# EAGLE design tactile (EAGLE 5.10)
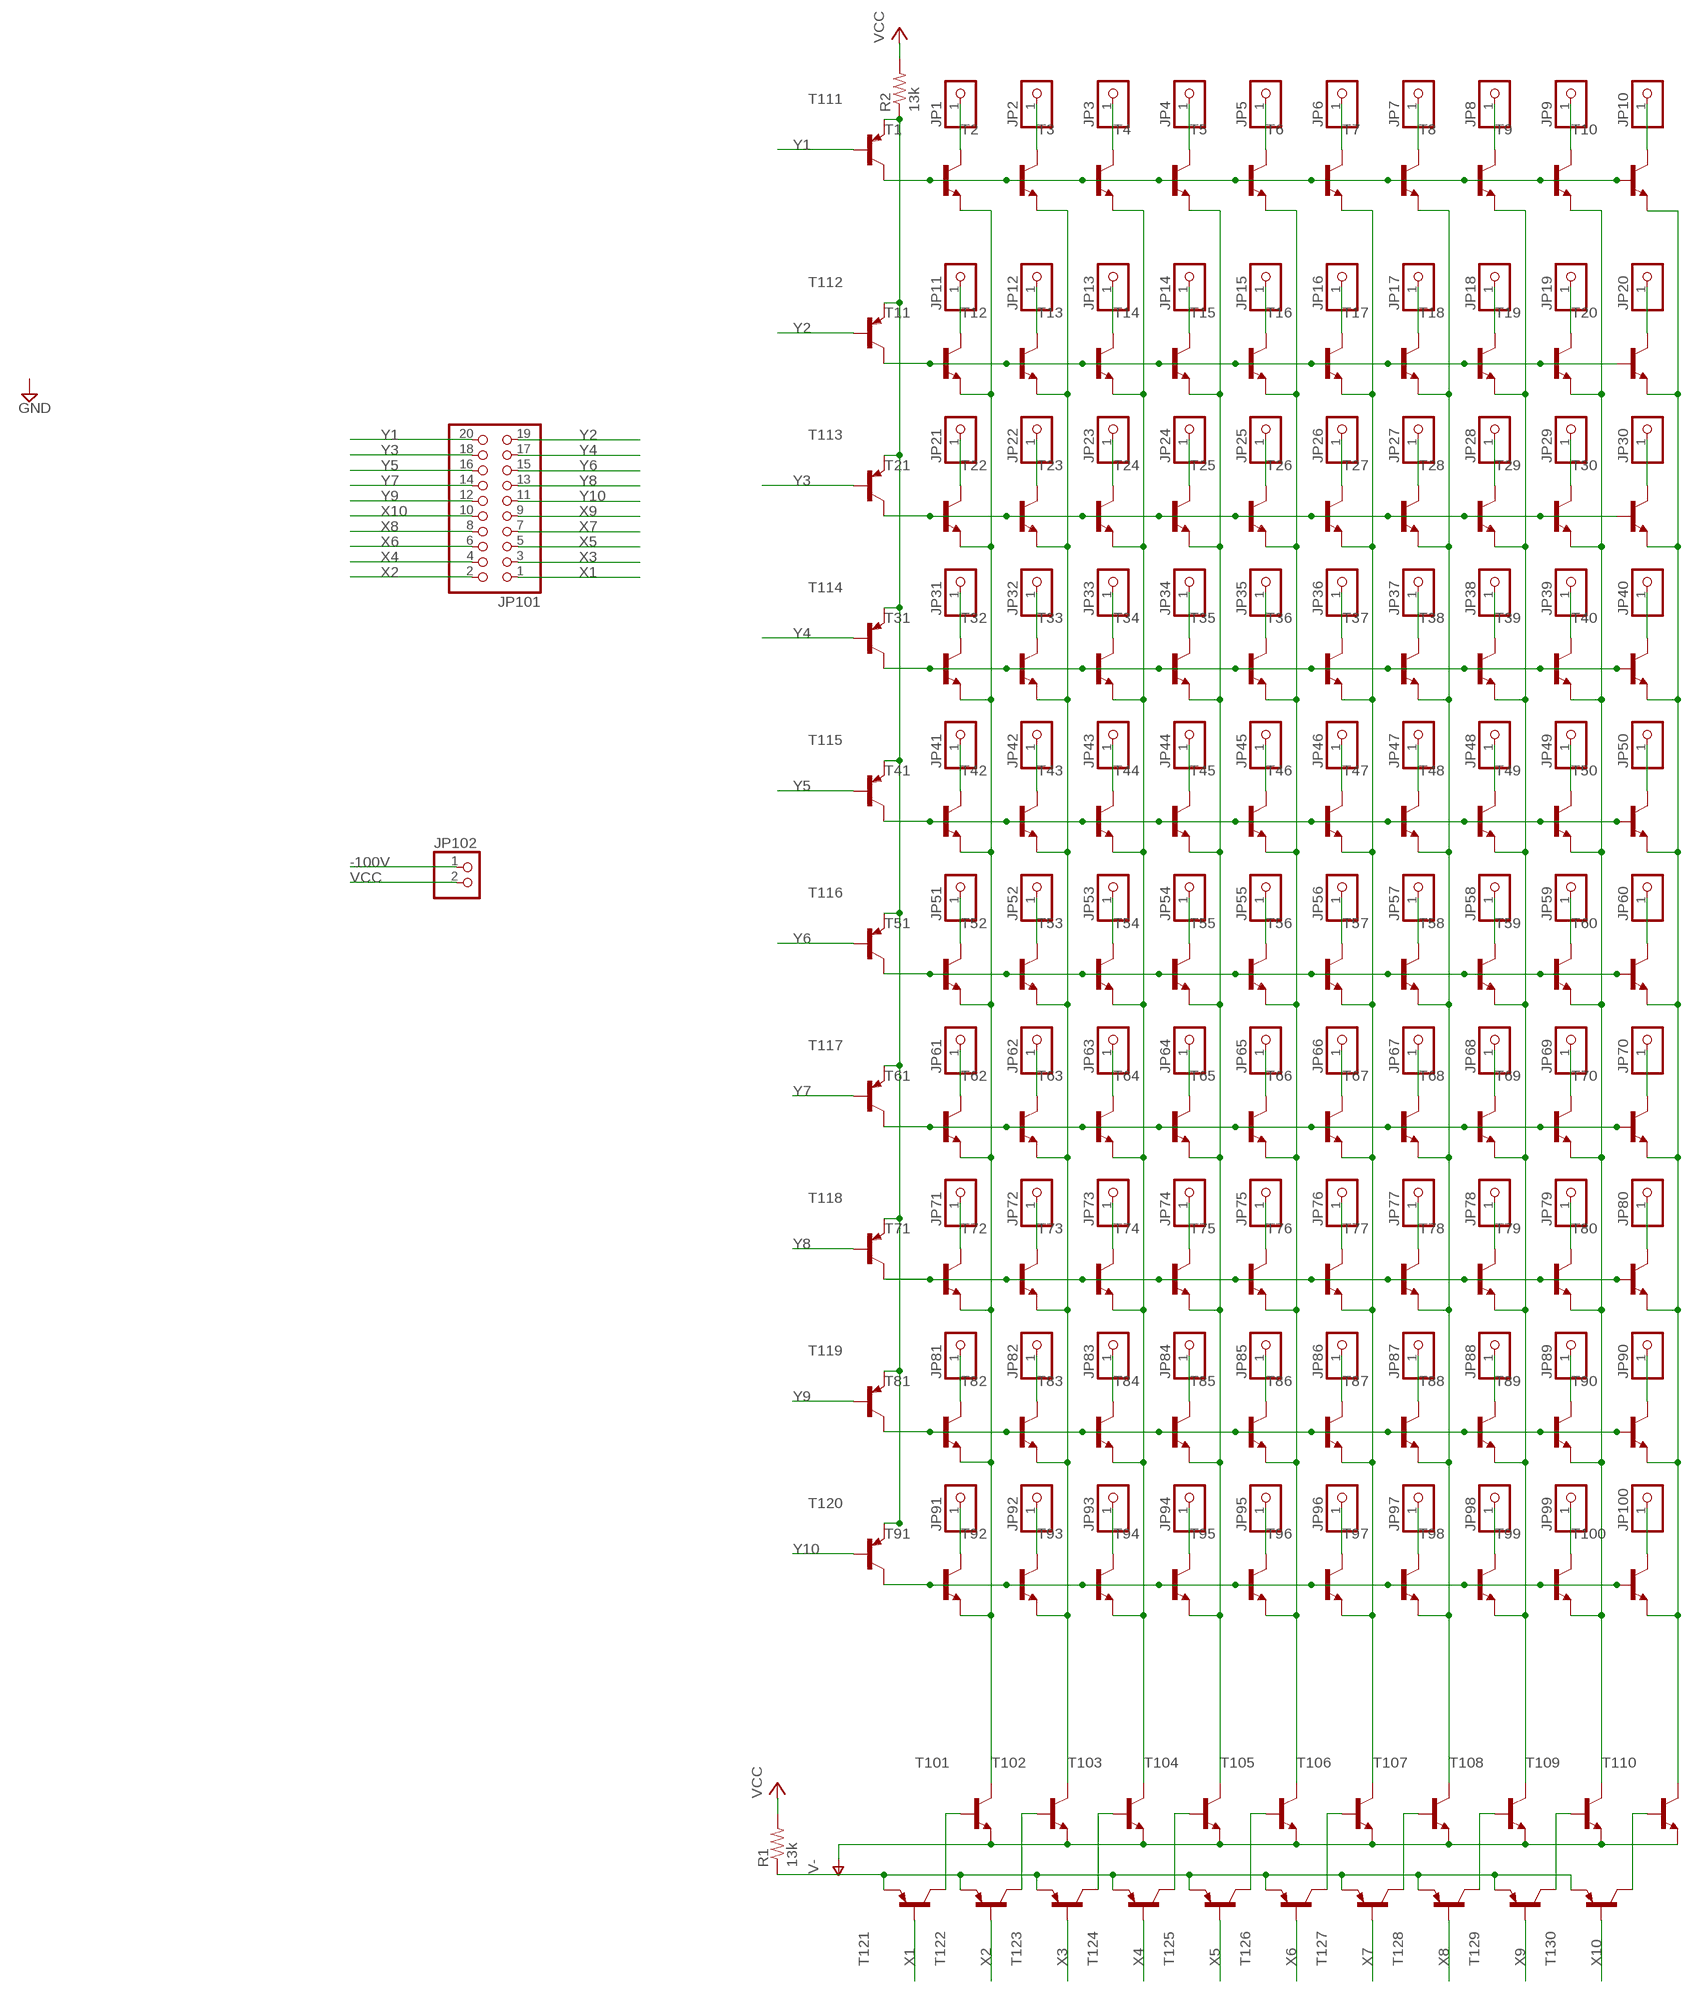
[diagram p0: schematic, sheet 1]

## Parts
JP1  PINHD-1X1  [1X01]
JP2  PINHD-1X1  [1X01]
JP3  PINHD-1X1  [1X01]
JP4  PINHD-1X1  [1X01]
JP5  PINHD-1X1  [1X01]
JP6  PINHD-1X1  [1X01]
JP7  PINHD-1X1  [1X01]
JP8  PINHD-1X1  [1X01]
JP9  PINHD-1X1  [1X01]
JP10  PINHD-1X1  [1X01]
JP11  PINHD-1X1  [1X01]
JP12  PINHD-1X1  [1X01]
JP13  PINHD-1X1  [1X01]
JP14  PINHD-1X1  [1X01]
JP15  PINHD-1X1  [1X01]
JP16  PINHD-1X1  [1X01]
JP17  PINHD-1X1  [1X01]
JP18  PINHD-1X1  [1X01]
JP19  PINHD-1X1  [1X01]
JP20  PINHD-1X1  [1X01]
JP21  PINHD-1X1  [1X01]
JP22  PINHD-1X1  [1X01]
JP23  PINHD-1X1  [1X01]
JP24  PINHD-1X1  [1X01]
JP25  PINHD-1X1  [1X01]
JP26  PINHD-1X1  [1X01]
JP27  PINHD-1X1  [1X01]
JP28  PINHD-1X1  [1X01]
JP29  PINHD-1X1  [1X01]
JP30  PINHD-1X1  [1X01]
JP31  PINHD-1X1  [1X01]
JP32  PINHD-1X1  [1X01]
JP33  PINHD-1X1  [1X01]
JP34  PINHD-1X1  [1X01]
JP35  PINHD-1X1  [1X01]
JP36  PINHD-1X1  [1X01]
JP37  PINHD-1X1  [1X01]
JP38  PINHD-1X1  [1X01]
JP39  PINHD-1X1  [1X01]
JP40  PINHD-1X1  [1X01]
JP41  PINHD-1X1  [1X01]
JP42  PINHD-1X1  [1X01]
JP43  PINHD-1X1  [1X01]
JP44  PINHD-1X1  [1X01]
JP45  PINHD-1X1  [1X01]
JP46  PINHD-1X1  [1X01]
JP47  PINHD-1X1  [1X01]
JP48  PINHD-1X1  [1X01]
JP49  PINHD-1X1  [1X01]
JP50  PINHD-1X1  [1X01]
JP51  PINHD-1X1  [1X01]
JP52  PINHD-1X1  [1X01]
JP53  PINHD-1X1  [1X01]
JP54  PINHD-1X1  [1X01]
JP55  PINHD-1X1  [1X01]
JP56  PINHD-1X1  [1X01]
JP57  PINHD-1X1  [1X01]
JP58  PINHD-1X1  [1X01]
JP59  PINHD-1X1  [1X01]
JP60  PINHD-1X1  [1X01]
JP61  PINHD-1X1  [1X01]
JP62  PINHD-1X1  [1X01]
JP63  PINHD-1X1  [1X01]
JP64  PINHD-1X1  [1X01]
JP65  PINHD-1X1  [1X01]
JP66  PINHD-1X1  [1X01]
JP67  PINHD-1X1  [1X01]
JP68  PINHD-1X1  [1X01]
JP69  PINHD-1X1  [1X01]
JP70  PINHD-1X1  [1X01]
JP71  PINHD-1X1  [1X01]
JP72  PINHD-1X1  [1X01]
JP73  PINHD-1X1  [1X01]
JP74  PINHD-1X1  [1X01]
JP75  PINHD-1X1  [1X01]
JP76  PINHD-1X1  [1X01]
JP77  PINHD-1X1  [1X01]
JP78  PINHD-1X1  [1X01]
JP79  PINHD-1X1  [1X01]
JP80  PINHD-1X1  [1X01]
JP81  PINHD-1X1  [1X01]
JP82  PINHD-1X1  [1X01]
JP83  PINHD-1X1  [1X01]
JP84  PINHD-1X1  [1X01]
JP85  PINHD-1X1  [1X01]
JP86  PINHD-1X1  [1X01]
JP87  PINHD-1X1  [1X01]
JP88  PINHD-1X1  [1X01]
JP89  PINHD-1X1  [1X01]
JP90  PINHD-1X1  [1X01]
JP91  PINHD-1X1  [1X01]
JP92  PINHD-1X1  [1X01]
JP93  PINHD-1X1  [1X01]
JP94  PINHD-1X1  [1X01]
JP95  PINHD-1X1  [1X01]
JP96  PINHD-1X1  [1X01]
JP97  PINHD-1X1  [1X01]
JP98  PINHD-1X1  [1X01]
JP99  PINHD-1X1  [1X01]
JP100  PINHD-1X1  [1X01]
JP101  PINHD-2X10/90  [2X10/90]
JP102  PINHD-1X2/90  [1X02/90]
R1  13k  R-US_M0805  [M0805]
R2  13k  R-US_M0805  [M0805]
T1  BC808-NPN-SOT23-BEC  [SOT23-BEC]
T2  BC808-NPN-SOT23-BEC  [SOT23-BEC]
T3  BC808-NPN-SOT23-BEC  [SOT23-BEC]
T4  BC808-NPN-SOT23-BEC  [SOT23-BEC]
T5  BC808-NPN-SOT23-BEC  [SOT23-BEC]
T6  BC808-NPN-SOT23-BEC  [SOT23-BEC]
T7  BC808-NPN-SOT23-BEC  [SOT23-BEC]
T8  BC808-NPN-SOT23-BEC  [SOT23-BEC]
T9  BC808-NPN-SOT23-BEC  [SOT23-BEC]
T10  BC808-NPN-SOT23-BEC  [SOT23-BEC]
T11  BC808-NPN-SOT23-BEC  [SOT23-BEC]
T12  BC808-NPN-SOT23-BEC  [SOT23-BEC]
T13  BC808-NPN-SOT23-BEC  [SOT23-BEC]
T14  BC808-NPN-SOT23-BEC  [SOT23-BEC]
T15  BC808-NPN-SOT23-BEC  [SOT23-BEC]
T16  BC808-NPN-SOT23-BEC  [SOT23-BEC]
T17  BC808-NPN-SOT23-BEC  [SOT23-BEC]
T18  BC808-NPN-SOT23-BEC  [SOT23-BEC]
T19  BC808-NPN-SOT23-BEC  [SOT23-BEC]
T20  BC808-NPN-SOT23-BEC  [SOT23-BEC]
T21  BC808-NPN-SOT23-BEC  [SOT23-BEC]
T22  BC808-NPN-SOT23-BEC  [SOT23-BEC]
T23  BC808-NPN-SOT23-BEC  [SOT23-BEC]
T24  BC808-NPN-SOT23-BEC  [SOT23-BEC]
T25  BC808-NPN-SOT23-BEC  [SOT23-BEC]
T26  BC808-NPN-SOT23-BEC  [SOT23-BEC]
T27  BC808-NPN-SOT23-BEC  [SOT23-BEC]
T28  BC808-NPN-SOT23-BEC  [SOT23-BEC]
T29  BC808-NPN-SOT23-BEC  [SOT23-BEC]
T30  BC808-NPN-SOT23-BEC  [SOT23-BEC]
T31  BC808-NPN-SOT23-BEC  [SOT23-BEC]
T32  BC808-NPN-SOT23-BEC  [SOT23-BEC]
T33  BC808-NPN-SOT23-BEC  [SOT23-BEC]
T34  BC808-NPN-SOT23-BEC  [SOT23-BEC]
T35  BC808-NPN-SOT23-BEC  [SOT23-BEC]
T36  BC808-NPN-SOT23-BEC  [SOT23-BEC]
T37  BC808-NPN-SOT23-BEC  [SOT23-BEC]
T38  BC808-NPN-SOT23-BEC  [SOT23-BEC]
T39  BC808-NPN-SOT23-BEC  [SOT23-BEC]
T40  BC808-NPN-SOT23-BEC  [SOT23-BEC]
T41  BC808-NPN-SOT23-BEC  [SOT23-BEC]
T42  BC808-NPN-SOT23-BEC  [SOT23-BEC]
T43  BC808-NPN-SOT23-BEC  [SOT23-BEC]
T44  BC808-NPN-SOT23-BEC  [SOT23-BEC]
T45  BC808-NPN-SOT23-BEC  [SOT23-BEC]
T46  BC808-NPN-SOT23-BEC  [SOT23-BEC]
T47  BC808-NPN-SOT23-BEC  [SOT23-BEC]
T48  BC808-NPN-SOT23-BEC  [SOT23-BEC]
T49  BC808-NPN-SOT23-BEC  [SOT23-BEC]
T50  BC808-NPN-SOT23-BEC  [SOT23-BEC]
T51  BC808-NPN-SOT23-BEC  [SOT23-BEC]
T52  BC808-NPN-SOT23-BEC  [SOT23-BEC]
T53  BC808-NPN-SOT23-BEC  [SOT23-BEC]
T54  BC808-NPN-SOT23-BEC  [SOT23-BEC]
T55  BC808-NPN-SOT23-BEC  [SOT23-BEC]
T56  BC808-NPN-SOT23-BEC  [SOT23-BEC]
T57  BC808-NPN-SOT23-BEC  [SOT23-BEC]
T58  BC808-NPN-SOT23-BEC  [SOT23-BEC]
T59  BC808-NPN-SOT23-BEC  [SOT23-BEC]
T60  BC808-NPN-SOT23-BEC  [SOT23-BEC]
T61  BC808-NPN-SOT23-BEC  [SOT23-BEC]
T62  BC808-NPN-SOT23-BEC  [SOT23-BEC]
T63  BC808-NPN-SOT23-BEC  [SOT23-BEC]
T64  BC808-NPN-SOT23-BEC  [SOT23-BEC]
T65  BC808-NPN-SOT23-BEC  [SOT23-BEC]
T66  BC808-NPN-SOT23-BEC  [SOT23-BEC]
T67  BC808-NPN-SOT23-BEC  [SOT23-BEC]
T68  BC808-NPN-SOT23-BEC  [SOT23-BEC]
T69  BC808-NPN-SOT23-BEC  [SOT23-BEC]
T70  BC808-NPN-SOT23-BEC  [SOT23-BEC]
T71  BC808-NPN-SOT23-BEC  [SOT23-BEC]
T72  BC808-NPN-SOT23-BEC  [SOT23-BEC]
T73  BC808-NPN-SOT23-BEC  [SOT23-BEC]
T74  BC808-NPN-SOT23-BEC  [SOT23-BEC]
T75  BC808-NPN-SOT23-BEC  [SOT23-BEC]
T76  BC808-NPN-SOT23-BEC  [SOT23-BEC]
T77  BC808-NPN-SOT23-BEC  [SOT23-BEC]
T78  BC808-NPN-SOT23-BEC  [SOT23-BEC]
T79  BC808-NPN-SOT23-BEC  [SOT23-BEC]
T80  BC808-NPN-SOT23-BEC  [SOT23-BEC]
T81  BC808-NPN-SOT23-BEC  [SOT23-BEC]
T82  BC808-NPN-SOT23-BEC  [SOT23-BEC]
T83  BC808-NPN-SOT23-BEC  [SOT23-BEC]
T84  BC808-NPN-SOT23-BEC  [SOT23-BEC]
T85  BC808-NPN-SOT23-BEC  [SOT23-BEC]
T86  BC808-NPN-SOT23-BEC  [SOT23-BEC]
T87  BC808-NPN-SOT23-BEC  [SOT23-BEC]
T88  BC808-NPN-SOT23-BEC  [SOT23-BEC]
T89  BC808-NPN-SOT23-BEC  [SOT23-BEC]
T90  BC808-NPN-SOT23-BEC  [SOT23-BEC]
T91  BC808-NPN-SOT23-BEC  [SOT23-BEC]
T92  BC808-NPN-SOT23-BEC  [SOT23-BEC]
T93  BC808-NPN-SOT23-BEC  [SOT23-BEC]
T94  BC808-NPN-SOT23-BEC  [SOT23-BEC]
T95  BC808-NPN-SOT23-BEC  [SOT23-BEC]
T96  BC808-NPN-SOT23-BEC  [SOT23-BEC]
T97  BC808-NPN-SOT23-BEC  [SOT23-BEC]
T98  BC808-NPN-SOT23-BEC  [SOT23-BEC]
T99  BC808-NPN-SOT23-BEC  [SOT23-BEC]
T100  BC808-NPN-SOT23-BEC  [SOT23-BEC]
T101  BC808-NPN-SOT23-BEC  [SOT23-BEC]
T102  BC808-NPN-SOT23-BEC  [SOT23-BEC]
T103  BC808-NPN-SOT23-BEC  [SOT23-BEC]
T104  BC808-NPN-SOT23-BEC  [SOT23-BEC]
T105  BC808-NPN-SOT23-BEC  [SOT23-BEC]
T106  BC808-NPN-SOT23-BEC  [SOT23-BEC]
T107  BC808-NPN-SOT23-BEC  [SOT23-BEC]
T108  BC808-NPN-SOT23-BEC  [SOT23-BEC]
T109  BC808-NPN-SOT23-BEC  [SOT23-BEC]
T110  BC808-NPN-SOT23-BEC  [SOT23-BEC]
T111  BC807-16-PNP-SOT23-BEC  [SOT23-BEC]
T112  BC807-16-PNP-SOT23-BEC  [SOT23-BEC]
T113  BC807-16-PNP-SOT23-BEC  [SOT23-BEC]
T114  BC807-16-PNP-SOT23-BEC  [SOT23-BEC]
T115  BC807-16-PNP-SOT23-BEC  [SOT23-BEC]
T116  BC807-16-PNP-SOT23-BEC  [SOT23-BEC]
T117  BC807-16-PNP-SOT23-BEC  [SOT23-BEC]
T118  BC807-16-PNP-SOT23-BEC  [SOT23-BEC]
T119  BC807-16-PNP-SOT23-BEC  [SOT23-BEC]
T120  BC807-16-PNP-SOT23-BEC  [SOT23-BEC]
T121  BC807-16-PNP-SOT23-BEC  [SOT23-BEC]
T122  BC807-16-PNP-SOT23-BEC  [SOT23-BEC]
T123  BC807-16-PNP-SOT23-BEC  [SOT23-BEC]
T124  BC807-16-PNP-SOT23-BEC  [SOT23-BEC]
T125  BC807-16-PNP-SOT23-BEC  [SOT23-BEC]
T126  BC807-16-PNP-SOT23-BEC  [SOT23-BEC]
T127  BC807-16-PNP-SOT23-BEC  [SOT23-BEC]
T128  BC807-16-PNP-SOT23-BEC  [SOT23-BEC]
T129  BC807-16-PNP-SOT23-BEC  [SOT23-BEC]
T130  BC807-16-PNP-SOT23-BEC  [SOT23-BEC]

## Nets
-100V: JP102.1 T101.E T102.E T103.E T104.E T105.E T106.E T107.E T108.E T109.E T110.E ; supply symbol labelled V-
N$1: T1.B T2.B T3.B T4.B T5.B T6.B T7.B T8.B T9.B T10.B T111.C
N$2: JP1.1 T1.C
N$3: JP2.1 T2.C
N$4: JP3.1 T3.C
N$5: JP4.1 T4.C
N$6: JP5.1 T5.C
N$7: JP6.1 T6.C
N$8: JP7.1 T7.C
N$9: JP8.1 T8.C
N$10: JP9.1 T9.C
N$11: JP10.1 T10.C
N$12: T11.B T12.B T13.B T14.B T15.B T16.B T17.B T18.B T19.B T20.B T112.C
N$13: JP11.1 T11.C
N$14: JP12.1 T12.C
N$15: JP13.1 T13.C
N$16: JP14.1 T14.C
N$17: JP15.1 T15.C
N$18: JP16.1 T16.C
N$19: JP17.1 T17.C
N$20: JP18.1 T18.C
N$21: JP19.1 T19.C
N$22: JP20.1 T20.C
N$23: T1.E T11.E T21.E T31.E T41.E T51.E T61.E T71.E T81.E T91.E T101.C
N$24: T2.E T12.E T22.E T32.E T42.E T52.E T62.E T72.E T82.E T92.E T102.C
N$25: T3.E T13.E T23.E T33.E T43.E T53.E T63.E T73.E T83.E T93.E T103.C
N$26: T4.E T14.E T24.E T34.E T44.E T54.E T64.E T74.E T84.E T94.E T104.C
N$27: T5.E T15.E T25.E T35.E T45.E T55.E T65.E T75.E T85.E T95.E T105.C
N$28: T6.E T16.E T26.E T36.E T46.E T56.E T66.E T76.E T86.E T96.E T106.C
N$29: T7.E T17.E T27.E T37.E T47.E T57.E T67.E T77.E T87.E T97.E T107.C
N$30: T8.E T18.E T28.E T38.E T48.E T58.E T68.E T78.E T88.E T98.E T108.C
N$31: T9.E T19.E T29.E T39.E T49.E T59.E T69.E T79.E T89.E T99.E T109.C
N$32: T10.E T20.E T30.E T40.E T50.E T60.E T70.E T80.E T90.E T100.E T110.C
N$33: T21.B T22.B T23.B T24.B T25.B T26.B T27.B T28.B T29.B T30.B T113.C
N$34: JP21.1 T21.C
N$35: JP22.1 T22.C
N$36: JP23.1 T23.C
N$37: JP24.1 T24.C
N$38: JP25.1 T25.C
N$39: JP26.1 T26.C
N$40: JP27.1 T27.C
N$41: JP28.1 T28.C
N$42: JP29.1 T29.C
N$43: JP30.1 T30.C
N$44: T91.B T92.B T93.B T94.B T95.B T96.B T97.B T98.B T99.B T100.B T120.C
N$45: JP31.1 T31.C
N$46: JP32.1 T32.C
N$47: JP33.1 T33.C
N$48: JP34.1 T34.C
N$49: JP35.1 T35.C
N$50: JP36.1 T36.C
N$51: JP37.1 T37.C
N$52: JP38.1 T38.C
N$53: JP39.1 T39.C
N$54: JP40.1 T40.C
N$55: T81.B T82.B T83.B T84.B T85.B T86.B T87.B T88.B T89.B T90.B T119.C
N$56: JP41.1 T41.C
N$57: JP42.1 T42.C
N$58: JP43.1 T43.C
N$59: JP44.1 T44.C
N$60: JP45.1 T45.C
N$61: JP46.1 T46.C
N$62: JP47.1 T47.C
N$63: JP48.1 T48.C
N$64: JP49.1 T49.C
N$65: JP50.1 T50.C
N$66: T71.B T72.B T73.B T74.B T75.B T76.B T77.B T78.B T79.B T80.B T118.C
N$67: JP51.1 T51.C
N$68: JP52.1 T52.C
N$69: JP53.1 T53.C
N$70: JP54.1 T54.C
N$71: JP55.1 T55.C
N$72: JP56.1 T56.C
N$73: JP57.1 T57.C
N$74: JP58.1 T58.C
N$75: JP59.1 T59.C
N$76: JP60.1 T60.C
N$77: T61.B T62.B T63.B T64.B T65.B T66.B T67.B T68.B T69.B T70.B T117.C
N$78: JP61.1 T61.C
N$79: JP62.1 T62.C
N$80: JP63.1 T63.C
N$81: JP64.1 T64.C
N$82: JP65.1 T65.C
N$83: JP66.1 T66.C
N$84: JP67.1 T67.C
N$85: JP68.1 T68.C
N$86: JP69.1 T69.C
N$87: JP70.1 T70.C
N$88: T51.B T52.B T53.B T54.B T55.B T56.B T57.B T58.B T59.B T60.B T116.C
N$89: JP71.1 T71.C
N$90: JP72.1 T72.C
N$91: JP73.1 T73.C
N$92: JP74.1 T74.C
N$93: JP75.1 T75.C
N$94: JP76.1 T76.C
N$95: JP77.1 T77.C
N$96: JP78.1 T78.C
N$97: JP79.1 T79.C
N$98: JP80.1 T80.C
N$99: T41.B T42.B T43.B T44.B T45.B T46.B T47.B T48.B T49.B T50.B T115.C
N$100: JP81.1 T81.C
N$101: JP82.1 T82.C
N$102: JP83.1 T83.C
N$103: JP84.1 T84.C
N$104: JP85.1 T85.C
N$105: JP86.1 T86.C
N$106: JP87.1 T87.C
N$107: JP88.1 T88.C
N$108: JP89.1 T89.C
N$109: JP90.1 T90.C
N$110: T31.B T32.B T33.B T34.B T35.B T36.B T37.B T38.B T39.B T40.B T114.C
N$111: JP91.1 T91.C
N$112: JP92.1 T92.C
N$113: JP93.1 T93.C
N$114: JP94.1 T94.C
N$115: JP95.1 T95.C
N$116: JP96.1 T96.C
N$117: JP97.1 T97.C
N$118: JP98.1 T98.C
N$119: JP99.1 T99.C
N$120: JP100.1 T100.C
N$121: T101.B T121.C
N$122: T102.B T122.C
N$123: T103.B T123.C
N$124: T104.B T124.C
N$125: T105.B T125.C
N$126: T106.B T126.C
N$127: T107.B T127.C
N$128: T108.B T128.C
N$129: T109.B T129.C
N$130: T110.B T130.C
N$131: R1.1 T121.E T122.E T123.E T124.E T125.E T126.E T127.E T128.E T129.E T130.E
N$132: R2.1 T111.E T112.E T113.E T114.E T115.E T116.E T117.E T118.E T119.E T120.E
VCC: JP102.2 R1.2 R2.2
X1: JP101.1 T121.B
X2: JP101.2 T122.B
X3: JP101.3 T123.B
X4: JP101.4 T124.B
X5: JP101.5 T125.B
X6: JP101.6 T126.B
X7: JP101.7 T127.B
X8: JP101.8 T128.B
X9: JP101.9 T129.B
X10: JP101.10 T130.B
Y1: JP101.20 T111.B
Y2: JP101.19 T112.B
Y3: JP101.18 T113.B
Y4: JP101.17 T114.B
Y5: JP101.16 T115.B
Y6: JP101.15 T116.B
Y7: JP101.14 T117.B
Y8: JP101.13 T118.B
Y9: JP101.12 T119.B
Y10: JP101.11 T120.B

## Library data of the parts
JP1-JP100 = pinhead:PINHD-1X1: PIN HEADER
JP101 = pinhead:PINHD-2X10: PIN HEADER
JP102 = pinhead:PINHD-1X2: PIN HEADER
R1 R2 = rcl:R-US_: RESISTOR, American symbol
T1-T110 = transistor:*-NPN-: NPN Transistror BF959 corrected 2008.03.06
T111-T130 = transistor:*-PNP-: PNP Transistror

## Board
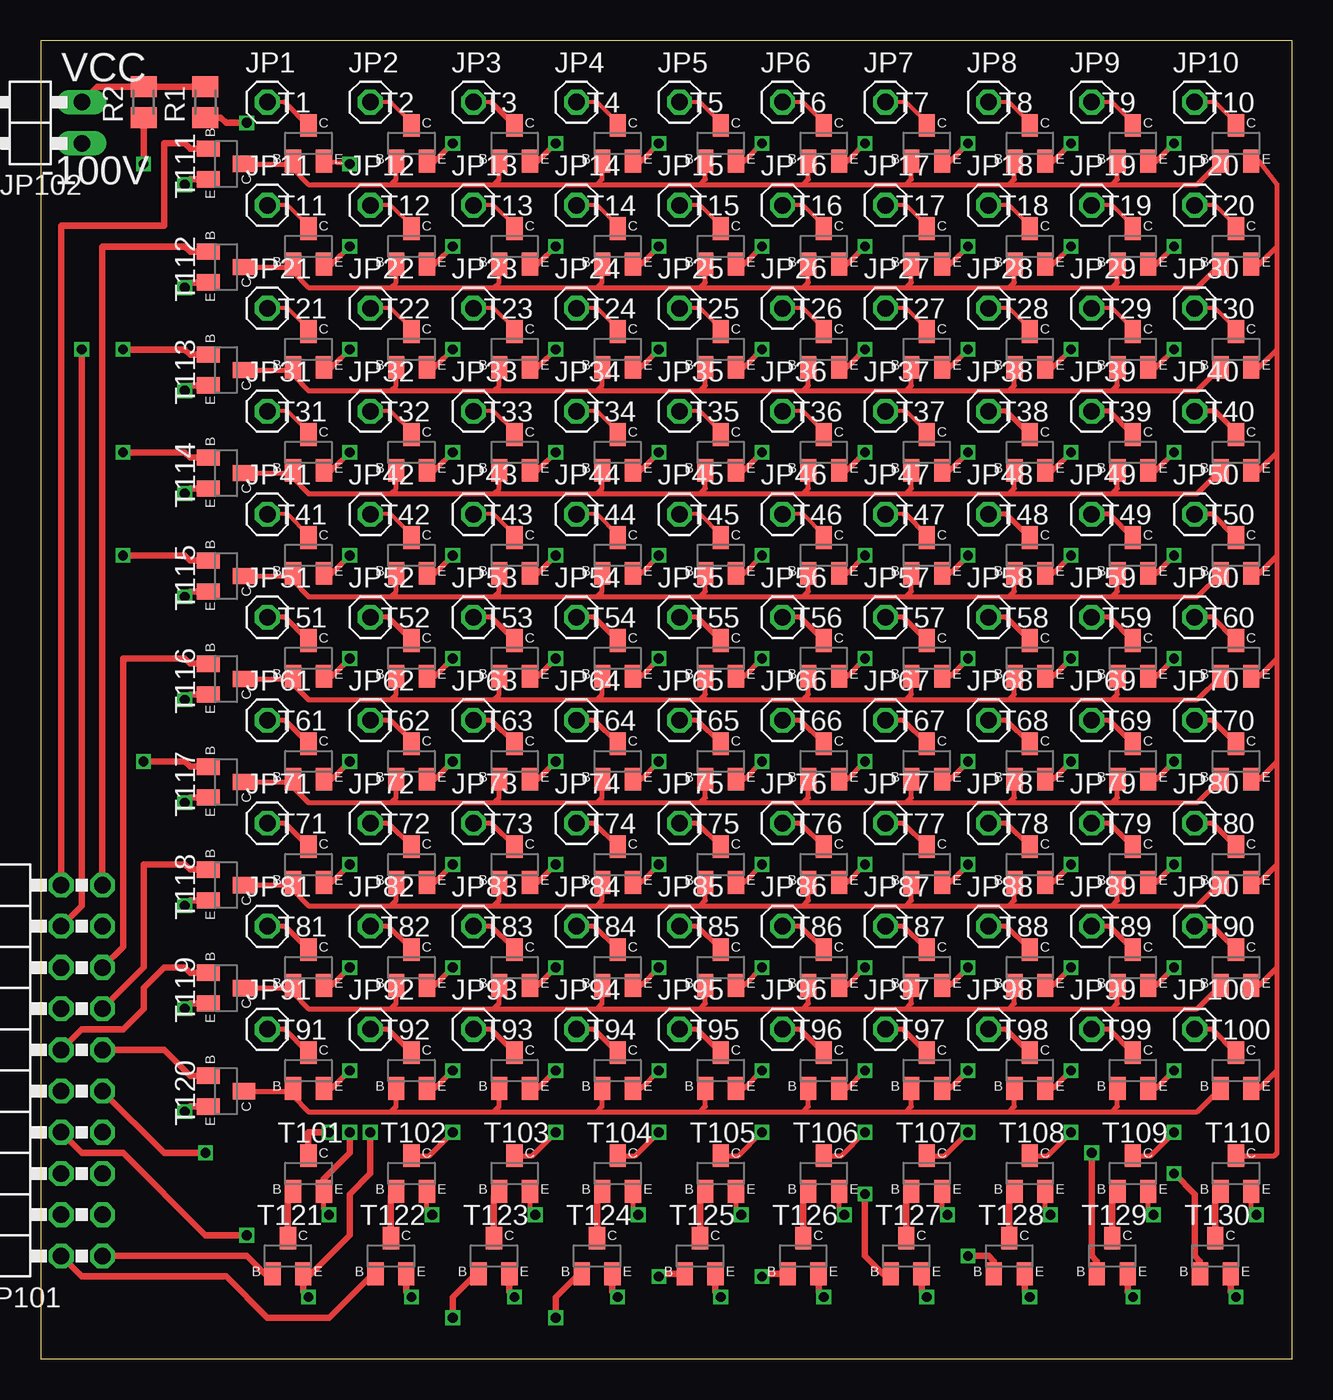
[diagram p1: board, top side]
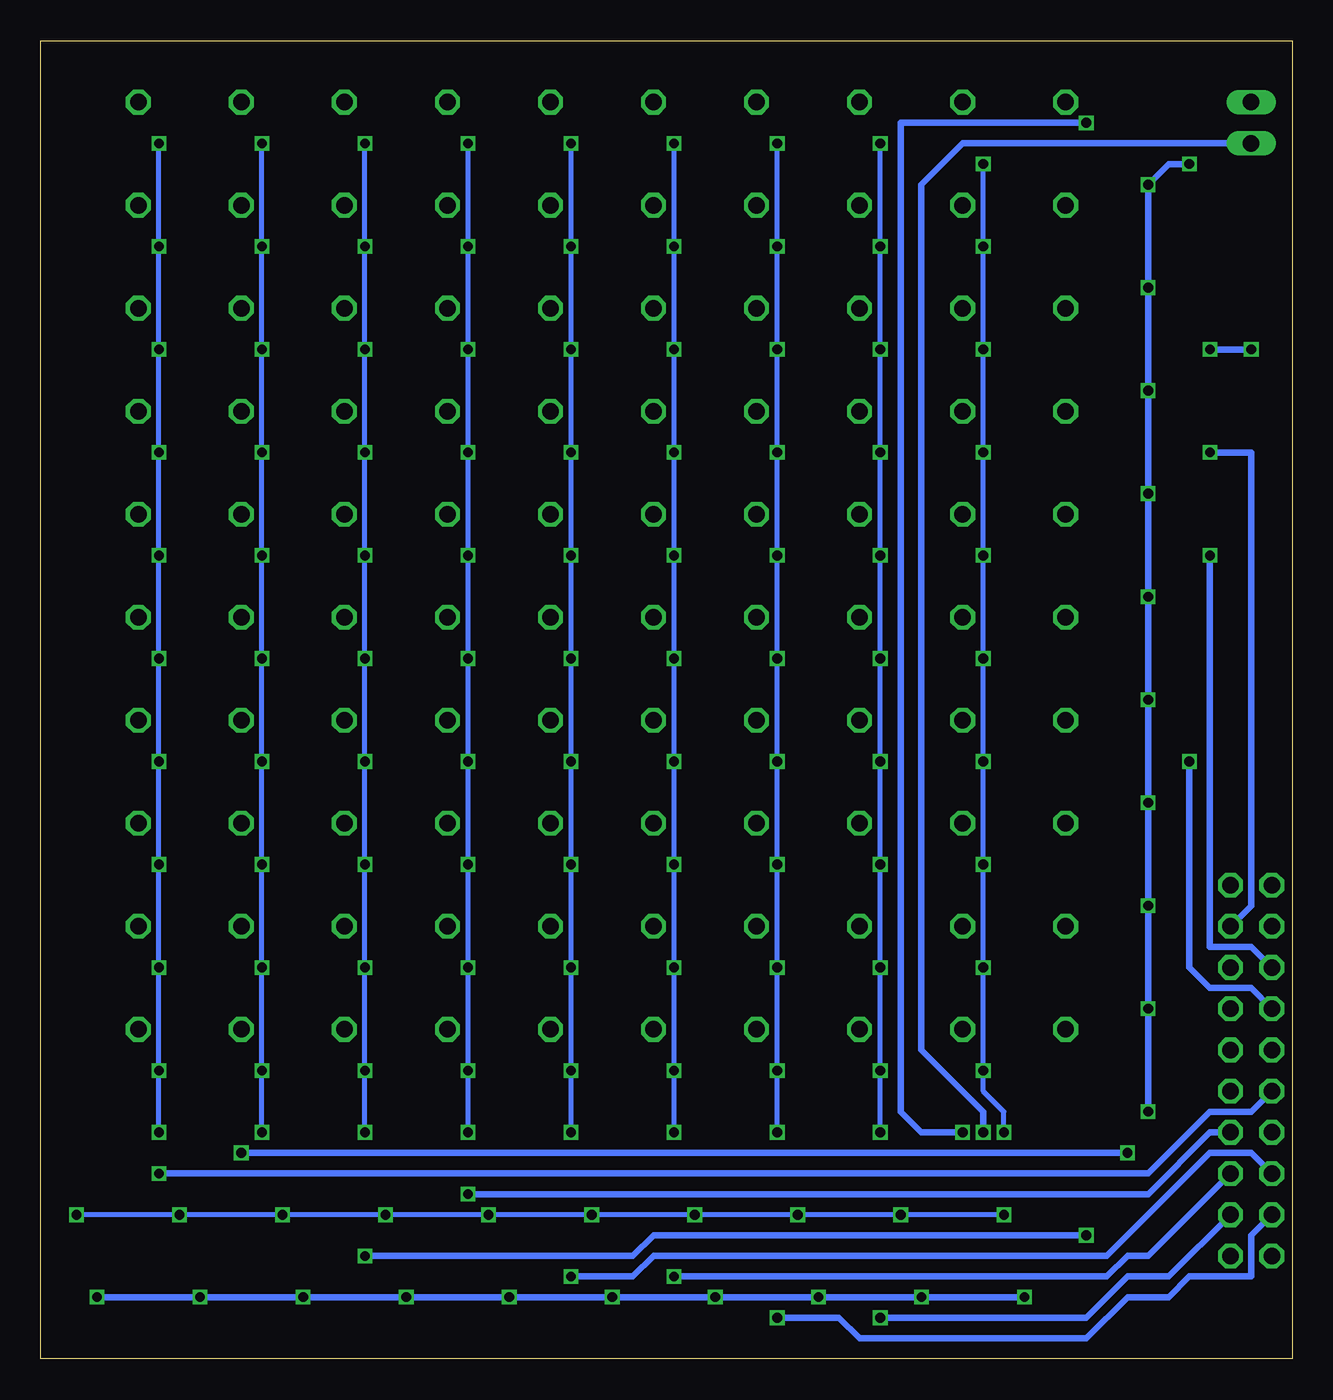
[diagram p2: board, bottom side, seen from below]

Size 77.14 x 81.27 mm. Coordinates in mm from the lower left corner, seen from the top.
Outline: 0,0 77.14,0 77.14,81.27 0,81.27 0,0
Copper layers (1*16): Top 0.035mm / dielectric 1.5mm / Bottom 0.035mm
Design rules "ITead_rule": minimum track width 6mil, minimum drill 12mil, track to track 6mil, track to pad 6mil, pad to pad 6mil, via to via 6mil, smd to smd 0mil, copper to edge 10mil, drill to drill 10mil, minimum pad ring 10mil, minimum via ring 6mil, stop-mask expansion 2mil, vias tented up to drill 100mil, thermal gap 10mil

### Footprints (pad centres in the part's own frame; a part is rotated, then mirrored left to right if it is on the bottom)
1X01 = drill 1.016 octagon: 1 0,0
2X10/90 = drill 1.016 octagon: 1 -11.43,-6.35; 2 -11.43,-3.81; 3 -8.89,-6.35; 4 -8.89,-3.81; 5 -6.35,-6.35; 6 -6.35,-3.81; 7 -3.81,-6.35; 8 -3.81,-3.81; 9 -1.27,-6.35; 10 -1.27,-3.81; 11 1.27,-6.35; 12 1.27,-3.81; 13 3.81,-6.35; 14 3.81,-3.81; 15 6.35,-6.35; 16 6.35,-3.81; 17 8.89,-6.35; 18 8.89,-3.81; 19 11.43,-6.35; 20 11.43,-3.81
1X02/90 = drill 1.016 long: 1 -1.27,-3.81; 2 1.27,-3.81
M0805 = smd 1.3 x 1.6: 1 -0.95,0; 2 0.95,0
SOT23-BEC = smd 1 x 1.4: B -0.95,-1.1; C 0,1.1; E 0.95,-1.1

### Placement (x,y rotation side)
JP1  13.97,77.47 0 top
JP2  20.32,77.47 0 top
JP3  26.67,77.47 0 top
JP4  33.02,77.47 0 top
JP5  39.37,77.47 0 top
JP6  45.72,77.47 0 top
JP7  52.07,77.47 0 top
JP8  58.42,77.47 0 top
JP9  64.77,77.47 0 top
JP10  71.12,77.47 0 top
JP11  13.97,71.12 0 top
JP12  20.32,71.12 0 top
JP13  26.67,71.12 0 top
JP14  33.02,71.12 0 top
JP15  39.37,71.12 0 top
JP16  45.72,71.12 0 top
JP17  52.07,71.12 0 top
JP18  58.42,71.12 0 top
JP19  64.77,71.12 0 top
JP20  71.12,71.12 0 top
JP21  13.97,64.77 0 top
JP22  20.32,64.77 0 top
JP23  26.67,64.77 0 top
JP24  33.02,64.77 0 top
JP25  39.37,64.77 0 top
JP26  45.72,64.77 0 top
JP27  52.07,64.77 0 top
JP28  58.42,64.77 0 top
JP29  64.77,64.77 0 top
JP30  71.12,64.77 0 top
JP31  13.97,58.42 0 top
JP32  20.32,58.42 0 top
JP33  26.67,58.42 0 top
JP34  33.02,58.42 0 top
JP35  39.37,58.42 0 top
JP36  45.72,58.42 0 top
JP37  52.07,58.42 0 top
JP38  58.42,58.42 0 top
JP39  64.77,58.42 0 top
JP40  71.12,58.42 0 top
JP41  13.97,52.07 0 top
JP42  20.32,52.07 0 top
JP43  26.67,52.07 0 top
JP44  33.02,52.07 0 top
JP45  39.37,52.07 0 top
JP46  45.72,52.07 0 top
JP47  52.07,52.07 0 top
JP48  58.42,52.07 0 top
JP49  64.77,52.07 0 top
JP50  71.12,52.07 0 top
JP51  13.97,45.72 0 top
JP52  20.32,45.72 0 top
JP53  26.67,45.72 0 top
JP54  33.02,45.72 0 top
JP55  39.37,45.72 0 top
JP56  45.72,45.72 0 top
JP57  52.07,45.72 0 top
JP58  58.42,45.72 0 top
JP59  64.77,45.72 0 top
JP60  71.12,45.72 0 top
JP61  13.97,39.37 0 top
JP62  20.32,39.37 0 top
JP63  26.67,39.37 0 top
JP64  33.02,39.37 0 top
JP65  39.37,39.37 0 top
JP66  45.72,39.37 0 top
JP67  52.07,39.37 0 top
JP68  58.42,39.37 0 top
JP69  64.77,39.37 0 top
JP70  71.12,39.37 0 top
JP71  13.97,33.02 0 top
JP72  20.32,33.02 0 top
JP73  26.67,33.02 0 top
JP74  33.02,33.02 0 top
JP75  39.37,33.02 0 top
JP76  45.72,33.02 0 top
JP77  52.07,33.02 0 top
JP78  58.42,33.02 0 top
JP79  64.77,33.02 0 top
JP80  71.12,33.02 0 top
JP81  13.97,26.67 0 top
JP82  20.32,26.67 0 top
JP83  26.67,26.67 0 top
JP84  33.02,26.67 0 top
JP85  39.37,26.67 0 top
JP86  45.72,26.67 0 top
JP87  52.07,26.67 0 top
JP88  58.42,26.67 0 top
JP89  64.77,26.67 0 top
JP90  71.12,26.67 0 top
JP91  13.97,20.32 0 top
JP92  20.32,20.32 0 top
JP93  26.67,20.32 0 top
JP94  33.02,20.32 0 top
JP95  39.37,20.32 0 top
JP96  45.72,20.32 0 top
JP97  52.07,20.32 0 top
JP98  58.42,20.32 0 top
JP99  64.77,20.32 0 top
JP100  71.12,20.32 0 top
JP101  -2.54,17.78 90 top
JP102  -1.27,76.2 90 top
R1  10.16,77.47 90 top
R2  6.35,77.47 90 top
T1  16.51,74.93 0 top
T2  22.86,74.93 0 top
T3  29.21,74.93 0 top
T4  35.56,74.93 0 top
T5  41.91,74.93 0 top
T6  48.26,74.93 0 top
T7  54.61,74.93 0 top
T8  60.96,74.93 0 top
T9  67.31,74.93 0 top
T10  73.66,74.93 0 top
T11  16.51,68.58 0 top
T12  22.86,68.58 0 top
T13  29.21,68.58 0 top
T14  35.56,68.58 0 top
T15  41.91,68.58 0 top
T16  48.26,68.58 0 top
T17  54.61,68.58 0 top
T18  60.96,68.58 0 top
T19  67.31,68.58 0 top
T20  73.66,68.58 0 top
T21  16.51,62.23 0 top
T22  22.86,62.23 0 top
T23  29.21,62.23 0 top
T24  35.56,62.23 0 top
T25  41.91,62.23 0 top
T26  48.26,62.23 0 top
T27  54.61,62.23 0 top
T28  60.96,62.23 0 top
T29  67.31,62.23 0 top
T30  73.66,62.23 0 top
T31  16.51,55.88 0 top
T32  22.86,55.88 0 top
T33  29.21,55.88 0 top
T34  35.56,55.88 0 top
T35  41.91,55.88 0 top
T36  48.26,55.88 0 top
T37  54.61,55.88 0 top
T38  60.96,55.88 0 top
T39  67.31,55.88 0 top
T40  73.66,55.88 0 top
T41  16.51,49.53 0 top
T42  22.86,49.53 0 top
T43  29.21,49.53 0 top
T44  35.56,49.53 0 top
T45  41.91,49.53 0 top
T46  48.26,49.53 0 top
T47  54.61,49.53 0 top
T48  60.96,49.53 0 top
T49  67.31,49.53 0 top
T50  73.66,49.53 0 top
T51  16.51,43.18 0 top
T52  22.86,43.18 0 top
T53  29.21,43.18 0 top
T54  35.56,43.18 0 top
T55  41.91,43.18 0 top
T56  48.26,43.18 0 top
T57  54.61,43.18 0 top
T58  60.96,43.18 0 top
T59  67.31,43.18 0 top
T60  73.66,43.18 0 top
T61  16.51,36.83 0 top
T62  22.86,36.83 0 top
T63  29.21,36.83 0 top
T64  35.56,36.83 0 top
T65  41.91,36.83 0 top
T66  48.26,36.83 0 top
T67  54.61,36.83 0 top
T68  60.96,36.83 0 top
T69  67.31,36.83 0 top
T70  73.66,36.83 0 top
T71  16.51,30.48 0 top
T72  22.86,30.48 0 top
T73  29.21,30.48 0 top
T74  35.56,30.48 0 top
T75  41.91,30.48 0 top
T76  48.26,30.48 0 top
T77  54.61,30.48 0 top
T78  60.96,30.48 0 top
T79  67.31,30.48 0 top
T80  73.66,30.48 0 top
T81  16.51,24.13 0 top
T82  22.86,24.13 0 top
T83  29.21,24.13 0 top
T84  35.56,24.13 0 top
T85  41.91,24.13 0 top
T86  48.26,24.13 0 top
T87  54.61,24.13 0 top
T88  60.96,24.13 0 top
T89  67.31,24.13 0 top
T90  73.66,24.13 0 top
T91  16.51,17.78 0 top
T92  22.86,17.78 0 top
T93  29.21,17.78 0 top
T94  35.56,17.78 0 top
T95  41.91,17.78 0 top
T96  48.26,17.78 0 top
T97  54.61,17.78 0 top
T98  60.96,17.78 0 top
T99  67.31,17.78 0 top
T100  73.66,17.78 0 top
T101  16.51,11.43 0 top
T102  22.86,11.43 0 top
T103  29.21,11.43 0 top
T104  35.56,11.43 0 top
T105  41.91,11.43 0 top
T106  48.26,11.43 0 top
T107  54.61,11.43 0 top
T108  60.96,11.43 0 top
T109  67.31,11.43 0 top
T110  73.66,11.43 0 top
T111  11.43,73.66 270 top
T112  11.43,67.31 270 top
T113  11.43,60.96 270 top
T114  11.43,54.61 270 top
T115  11.43,48.26 270 top
T116  11.43,41.91 270 top
T117  11.43,35.56 270 top
T118  11.43,29.21 270 top
T119  11.43,22.86 270 top
T120  11.43,16.51 270 top
T121  15.24,6.35 0 top
T122  21.59,6.35 0 top
T123  27.94,6.35 0 top
T124  34.29,6.35 0 top
T125  40.64,6.35 0 top
T126  46.99,6.35 0 top
T127  53.34,6.35 0 top
T128  59.69,6.35 0 top
T129  66.04,6.35 0 top
T130  72.39,6.35 0 top

### Tracks (layer width: path | path; a pad name or v marks a point on that pad's centre or on a via)
-100V  (via drill 0.6)
  Top 0.305: T102.E 23.81,9.21 v24.13,8.89 | T103.E 30.16,9.21 v30.48,8.89 | T104.E 36.51,9.21 v36.83,8.89 | T105.E 42.86,9.21 v43.18,8.89 | T106.E 49.21,9.21 v49.53,8.89 | T107.E 55.56,9.21 v55.88,8.89 | T108.E 61.91,9.21 v62.23,8.89 | T109.E 68.26,9.21 v68.58,8.89 | T101.E 17.46,9.21 v17.78,8.89 | T110.E 74.61,9.21 v74.93,8.89
  Top 0.406: T101.E 17.46,11.11 19.05,12.7 v19.05,13.97
  Bottom 0.305: v17.78,8.89 v24.13,8.89 v30.48,8.89 v36.83,8.89 v43.18,8.89 v49.53,8.89 v55.88,8.89 v62.23,8.89 v68.58,8.89 v74.93,8.89
  Bottom 0.406: v19.05,13.97 19.05,15.24 22.86,19.05 22.86,72.39 20.32,74.93 JP102.1
N$1
  Top 0.305: 21.59,72.39 16.51,72.39 15.56,73.34 T1.B 15.39,73.66 T111.C | 21.59,72.39 27.94,72.39 | 27.94,72.39 34.29,72.39 | 34.29,72.39 40.64,72.39 | 40.64,72.39 46.99,72.39 | 46.99,72.39 53.34,72.39 | 53.34,72.39 59.69,72.39 | 59.69,72.39 66.04,72.39 | 66.04,72.39 71.27,72.39 T10.B | T2.B 21.91,72.71 21.59,72.39 | T3.B 28.26,72.71 27.94,72.39 | T4.B 34.61,72.71 34.29,72.39 | T5.B 40.96,72.71 40.64,72.39 | T6.B 47.31,72.71 46.99,72.39 | T7.B 53.66,72.71 53.34,72.39 | T8.B 60.01,72.71 59.69,72.39 | T9.B 66.36,72.71 66.04,72.39
N$2
  Top 0.254: 15.07,77.47 JP1.1
  Top 0.305: T1.C 15.07,77.47
N$3
  Top 0.152: T2.C 22.86,76.2
  Top 0.254: JP2.1 21.59,77.47 22.86,76.2
N$4
  Top 0.254: 27.77,77.47 JP3.1
  Top 0.305: T3.C 27.77,77.47
N$5
  Top 0.152: T4.C 35.56,76.2
  Top 0.254: JP4.1 34.29,77.47 35.56,76.2
N$6
  Top 0.152: T5.C 41.91,76.2
  Top 0.254: JP5.1 40.64,77.47 41.91,76.2
N$7
  Top 0.152: T6.C 48.26,76.2
  Top 0.254: JP6.1 46.99,77.47 48.26,76.2
N$8
  Top 0.152: T7.C 54.61,76.2
  Top 0.254: JP7.1 53.34,77.47 54.61,76.2
N$9
  Top 0.152: T8.C 60.96,76.2
  Top 0.254: JP8.1 59.69,77.47 60.96,76.2
N$10
  Top 0.152: T9.C 67.31,76.2
  Top 0.254: JP9.1 66.04,77.47 67.31,76.2
N$11
  Top 0.152: T10.C 73.66,76.2
  Top 0.254: JP10.1 72.39,77.47 73.66,76.2
N$12
  Top 0.305: 21.59,66.04 16.51,66.04 15.56,66.99 T11.B 15.39,67.31 T112.C | 21.59,66.04 27.94,66.04 | 27.94,66.04 34.29,66.04 | 34.29,66.04 40.64,66.04 | 40.64,66.04 46.99,66.04 | 46.99,66.04 53.34,66.04 | 53.34,66.04 59.69,66.04 | 59.69,66.04 66.04,66.04 | 66.04,66.04 71.27,66.04 T20.B | T12.B 21.91,66.36 21.59,66.04 | T13.B 28.26,66.36 27.94,66.04 | T14.B 34.61,66.36 34.29,66.04 | T15.B 40.96,66.36 40.64,66.04 | T16.B 47.31,66.36 46.99,66.04 | T17.B 53.66,66.36 53.34,66.04 | T18.B 60.01,66.36 59.69,66.04 | T19.B 66.36,66.36 66.04,66.04
N$13
  Top 0.152: T11.C 16.51,69.85
  Top 0.254: JP11.1 15.24,71.12 16.51,69.85
N$14
  Top 0.152: T12.C 22.86,69.85
  Top 0.254: JP12.1 21.59,71.12 22.86,69.85
N$15
  Top 0.152: T13.C 29.21,69.85
  Top 0.254: JP13.1 27.94,71.12 29.21,69.85
N$16
  Top 0.152: T14.C 35.56,69.85
  Top 0.254: JP14.1 34.29,71.12 35.56,69.85
N$17
  Top 0.152: T15.C 41.91,69.85
  Top 0.254: JP15.1 40.64,71.12 41.91,69.85
N$18
  Top 0.152: T16.C 48.26,69.85
  Top 0.254: JP16.1 46.99,71.12 48.26,69.85
N$19
  Top 0.152: T17.C 54.61,69.85
  Top 0.254: JP17.1 53.34,71.12 54.61,69.85
N$20
  Top 0.152: T18.C 60.96,69.85
  Top 0.254: JP18.1 59.69,71.12 60.96,69.85
N$21
  Top 0.152: T19.C 67.31,69.85
  Top 0.254: JP19.1 66.04,71.12 67.31,69.85
N$22
  Top 0.152: T20.C 73.66,69.85
  Top 0.254: JP20.1 72.39,71.12 73.66,69.85
N$23  (via drill 0.6)
  Top 0.305: T11.E 17.95,67.48 v19.05,68.58 | T21.E 17.95,61.13 v19.05,62.23 | T31.E 17.95,54.78 v19.05,55.88 | T41.E 17.95,48.43 v19.05,49.53 | T51.E 17.95,42.08 v19.05,43.18 | T61.E 17.95,35.73 v19.05,36.83 | T71.E 17.95,29.38 v19.05,30.48 | T81.E 17.95,23.03 v19.05,24.13 | T91.E 17.95,16.68 v19.05,17.78 | v19.05,73.66 T1.E
  Top 0.406: T101.C 16.51,13.97 v17.78,13.97
  Bottom 0.305: v17.78,13.97 17.78,15.24 19.05,16.51 v19.05,17.78 v19.05,24.13 v19.05,30.48 v19.05,36.83 v19.05,43.18 v19.05,49.53 v19.05,55.88 v19.05,62.23 v19.05,68.58 v19.05,73.66
N$24  (via drill 0.6)
  Top 0.305: T2.E 24.3,73.83 v25.4,74.93 | T12.E 24.3,67.48 v25.4,68.58 | T22.E 24.3,61.13 v25.4,62.23 | T32.E 24.3,54.78 v25.4,55.88 | T42.E 24.3,48.43 v25.4,49.53 | T52.E 24.3,42.08 v25.4,43.18 | T62.E 24.3,35.73 v25.4,36.83 | T72.E 24.3,29.38 v25.4,30.48 | T82.E 24.3,23.03 v25.4,24.13 | T92.E 24.3,16.68 v25.4,17.78 | T102.C 23.96,12.53 v25.4,13.97
  Bottom 0.305: v25.4,13.97 v25.4,17.78 v25.4,24.13 v25.4,30.48 v25.4,36.83 v25.4,43.18 v25.4,49.53 v25.4,55.88 v25.4,62.23 v25.4,68.58 v25.4,74.93
N$25  (via drill 0.6)
  Top 0.305: T3.E 30.65,73.83 v31.75,74.93 | T13.E 30.65,67.48 v31.75,68.58 | T23.E 30.65,61.13 v31.75,62.23 | T33.E 30.65,54.78 v31.75,55.88 | T43.E 30.65,48.43 v31.75,49.53 | T53.E 30.65,42.08 v31.75,43.18 | T63.E 30.65,35.73 v31.75,36.83 | T73.E 30.65,29.38 v31.75,30.48 | T83.E 30.65,23.03 v31.75,24.13 | T93.E 30.65,16.68 v31.75,17.78 | T103.C 30.31,12.53 v31.75,13.97
  Bottom 0.305: v31.75,13.97 v31.75,17.78 v31.75,24.13 v31.75,30.48 v31.75,36.83 v31.75,43.18 v31.75,49.53 v31.75,55.88 v31.75,62.23 v31.75,68.58 v31.75,74.93
N$26  (via drill 0.6)
  Top 0.305: T4.E 37,73.83 v38.1,74.93 | T14.E 37,67.48 v38.1,68.58 | T24.E 37,61.13 v38.1,62.23 | T34.E 37,54.78 v38.1,55.88 | T44.E 37,48.43 v38.1,49.53 | T54.E 37,42.08 v38.1,43.18 | T64.E 37,35.73 v38.1,36.83 | T74.E 37,29.38 v38.1,30.48 | T84.E 37,23.03 v38.1,24.13 | T94.E 37,16.68 v38.1,17.78 | T104.C 36.66,12.53 v38.1,13.97
  Bottom 0.305: v38.1,13.97 v38.1,17.78 v38.1,24.13 v38.1,30.48 v38.1,36.83 v38.1,43.18 v38.1,49.53 v38.1,55.88 v38.1,62.23 v38.1,68.58 v38.1,74.93
N$27  (via drill 0.6)
  Top 0.305: T5.E 43.35,73.83 v44.45,74.93 | T15.E 43.35,67.48 v44.45,68.58 | T25.E 43.35,61.13 v44.45,62.23 | T35.E 43.35,54.78 v44.45,55.88 | T45.E 43.35,48.43 v44.45,49.53 | T55.E 43.35,42.08 v44.45,43.18 | T65.E 43.35,35.73 v44.45,36.83 | T75.E 43.35,29.38 v44.45,30.48 | T85.E 43.35,23.03 v44.45,24.13 | T95.E 43.35,16.68 v44.45,17.78 | T105.C 43.01,12.53 v44.45,13.97
  Bottom 0.305: v44.45,13.97 v44.45,17.78 v44.45,24.13 v44.45,30.48 v44.45,36.83 v44.45,43.18 v44.45,49.53 v44.45,55.88 v44.45,62.23 v44.45,68.58 v44.45,74.93
N$28  (via drill 0.6)
  Top 0.305: T6.E 49.7,73.83 v50.8,74.93 | T16.E 49.7,67.48 v50.8,68.58 | T26.E 49.7,61.13 v50.8,62.23 | T36.E 49.7,54.78 v50.8,55.88 | T46.E 49.7,48.43 v50.8,49.53 | T56.E 49.7,42.08 v50.8,43.18 | T66.E 49.7,35.73 v50.8,36.83 | T76.E 49.7,29.38 v50.8,30.48 | T86.E 49.7,23.03 v50.8,24.13 | T96.E 49.7,16.68 v50.8,17.78 | T106.C 49.36,12.53 v50.8,13.97
  Bottom 0.305: v50.8,13.97 v50.8,17.78 v50.8,24.13 v50.8,30.48 v50.8,36.83 v50.8,43.18 v50.8,49.53 v50.8,55.88 v50.8,62.23 v50.8,68.58 v50.8,74.93
N$29  (via drill 0.6)
  Top 0.305: T7.E 56.05,73.83 v57.15,74.93 | T17.E 56.05,67.48 v57.15,68.58 | T27.E 56.05,61.13 v57.15,62.23 | T37.E 56.05,54.78 v57.15,55.88 | T47.E 56.05,48.43 v57.15,49.53 | T57.E 56.05,42.08 v57.15,43.18 | T67.E 56.05,35.73 v57.15,36.83 | T77.E 56.05,29.38 v57.15,30.48 | T87.E 56.05,23.03 v57.15,24.13 | T97.E 56.05,16.68 v57.15,17.78 | T107.C 55.71,12.53 v57.15,13.97
  Bottom 0.305: v57.15,13.97 v57.15,17.78 v57.15,24.13 v57.15,30.48 v57.15,36.83 v57.15,43.18 v57.15,49.53 v57.15,55.88 v57.15,62.23 v57.15,68.58 v57.15,74.93
N$30  (via drill 0.6)
  Top 0.305: T8.E 62.4,73.83 v63.5,74.93 | T18.E 62.4,67.48 v63.5,68.58 | T28.E 62.4,61.13 v63.5,62.23 | T38.E 62.4,54.78 v63.5,55.88 | T48.E 62.4,48.43 v63.5,49.53 | T58.E 62.4,42.08 v63.5,43.18 | T68.E 62.4,35.73 v63.5,36.83 | T78.E 62.4,29.38 v63.5,30.48 | T88.E 62.4,23.03 v63.5,24.13 | T98.E 62.4,16.68 v63.5,17.78 | T108.C 62.06,12.53 v63.5,13.97
  Bottom 0.305: v63.5,13.97 v63.5,17.78 v63.5,24.13 v63.5,30.48 v63.5,36.83 v63.5,43.18 v63.5,49.53 v63.5,55.88 v63.5,62.23 v63.5,68.58 v63.5,74.93
N$31  (via drill 0.6)
  Top 0.305: T9.E 68.75,73.83 v69.85,74.93 | T19.E 68.75,67.48 v69.85,68.58 | T29.E 68.75,61.13 v69.85,62.23 | T39.E 68.75,54.78 v69.85,55.88 | T49.E 68.75,48.43 v69.85,49.53 | T59.E 68.75,42.08 v69.85,43.18 | T69.E 68.75,35.73 v69.85,36.83 | T79.E 68.75,29.38 v69.85,30.48 | T89.E 68.75,23.03 v69.85,24.13 | T99.E 68.75,16.68 v69.85,17.78 | T109.C 68.41,12.53 v69.85,13.97
  Bottom 0.305: v69.85,13.97 v69.85,17.78 v69.85,24.13 v69.85,30.48 v69.85,36.83 v69.85,43.18 v69.85,49.53 v69.85,55.88 v69.85,62.23 v69.85,68.58 v69.85,74.93
N$32
  Top 0.305: T10.E 75.1,73.83 76.2,72.39 76.2,68.58 | 76.2,17.78 76.2,12.7 76.03,12.53 T110.C | 76.2,17.78 76.2,24.13 | 76.2,24.13 76.2,30.48 | 76.2,30.48 76.2,36.83 | 76.2,36.83 76.2,43.18 | 76.2,43.18 76.2,49.53 | 76.2,49.53 76.2,55.88 | 76.2,55.88 76.2,62.23 | 76.2,62.23 76.2,68.58 | T20.E 75.1,67.48 76.2,68.58 | T30.E 75.1,61.13 76.2,62.23 | T40.E 75.1,54.78 76.2,55.88 | T50.E 75.1,48.43 76.2,49.53 | T60.E 75.1,42.08 76.2,43.18 | T70.E 75.1,35.73 76.2,36.83 | T80.E 75.1,29.38 76.2,30.48 | T90.E 75.1,23.03 76.2,24.13 | T100.E 75.1,16.68 76.2,17.78
N$33
  Top 0.305: 21.59,59.69 16.51,59.69 15.56,60.64 T21.B 15.39,60.96 T113.C | 21.59,59.69 27.94,59.69 | 27.94,59.69 34.29,59.69 | 34.29,59.69 40.64,59.69 | 40.64,59.69 46.99,59.69 | 46.99,59.69 53.34,59.69 | 53.34,59.69 59.69,59.69 | 59.69,59.69 66.04,59.69 | 66.04,59.69 71.27,59.69 T30.B | T22.B 21.91,60.01 21.59,59.69 | T23.B 28.26,60.01 27.94,59.69 | T24.B 34.61,60.01 34.29,59.69 | T25.B 40.96,60.01 40.64,59.69 | T26.B 47.31,60.01 46.99,59.69 | T27.B 53.66,60.01 53.34,59.69 | T28.B 60.01,60.01 59.69,59.69 | T29.B 66.36,60.01 66.04,59.69
N$34
  Top 0.152: T21.C 16.51,63.5
  Top 0.254: JP21.1 15.24,64.77 16.51,63.5
N$35
  Top 0.152: T22.C 22.86,63.5
  Top 0.254: JP22.1 21.59,64.77 22.86,63.5
N$36
  Top 0.152: T23.C 29.21,63.5
  Top 0.254: JP23.1 27.94,64.77 29.21,63.5
N$37
  Top 0.152: T24.C 35.56,63.5
  Top 0.254: JP24.1 34.29,64.77 35.56,63.5
N$38
  Top 0.152: T25.C 41.91,63.5
  Top 0.254: JP25.1 40.64,64.77 41.91,63.5
N$39
  Top 0.152: T26.C 48.26,63.5
  Top 0.254: JP26.1 46.99,64.77 48.26,63.5
N$40
  Top 0.152: T27.C 54.61,63.5
  Top 0.254: JP27.1 53.34,64.77 54.61,63.5
N$41
  Top 0.152: T28.C 60.96,63.5
  Top 0.254: JP28.1 59.69,64.77 60.96,63.5
N$42
  Top 0.152: T29.C 67.31,63.5
  Top 0.254: JP29.1 66.04,64.77 67.31,63.5
N$43
  Top 0.152: T30.C 73.66,63.5
  Top 0.254: JP30.1 72.39,64.77 73.66,63.5
N$44
  Top 0.305: 21.59,15.24 16.51,15.24 15.56,16.19 T91.B 15.39,16.51 T120.C | 21.59,15.24 27.94,15.24 | 27.94,15.24 34.29,15.24 | 34.29,15.24 40.64,15.24 | 40.64,15.24 46.99,15.24 | 46.99,15.24 53.34,15.24 | 53.34,15.24 59.69,15.24 | 59.69,15.24 66.04,15.24 | 66.04,15.24 71.27,15.24 T100.B | T92.B 21.91,15.56 21.59,15.24 | T93.B 28.26,15.56 27.94,15.24 | T94.B 34.61,15.56 34.29,15.24 | T95.B 40.96,15.56 40.64,15.24 | T96.B 47.31,15.56 46.99,15.24 | T97.B 53.66,15.56 53.34,15.24 | T98.B 60.01,15.56 59.69,15.24 | T99.B 66.36,15.56 66.04,15.24
N$45
  Top 0.152: T31.C 16.51,57.15
  Top 0.254: JP31.1 15.24,58.42 16.51,57.15
N$46
  Top 0.152: T32.C 22.86,57.15
  Top 0.254: JP32.1 21.59,58.42 22.86,57.15
N$47
  Top 0.152: T33.C 29.21,57.15
  Top 0.254: JP33.1 27.94,58.42 29.21,57.15
N$48
  Top 0.152: T34.C 35.56,57.15
  Top 0.254: JP34.1 34.29,58.42 35.56,57.15
N$49
  Top 0.152: T35.C 41.91,57.15
  Top 0.254: JP35.1 40.64,58.42 41.91,57.15
N$50
  Top 0.152: T36.C 48.26,57.15
  Top 0.254: JP36.1 46.99,58.42 48.26,57.15
N$51
  Top 0.152: T37.C 54.61,57.15
  Top 0.254: JP37.1 53.34,58.42 54.61,57.15
N$52
  Top 0.305: JP38.1 59.52,58.42 T38.C
N$53
  Top 0.305: JP39.1 65.87,58.42 T39.C
N$54
  Top 0.305: JP40.1 72.39,58.42 73.66,57.15 T40.C
N$55
  Top 0.305: 21.59,21.59 16.51,21.59 15.56,22.54 T81.B 15.39,22.86 T119.C | 21.59,21.59 27.94,21.59 | 27.94,21.59 34.29,21.59 | 34.29,21.59 40.64,21.59 | 40.64,21.59 46.99,21.59 | 46.99,21.59 53.34,21.59 | 53.34,21.59 59.69,21.59 | 59.69,21.59 66.04,21.59 | 66.04,21.59 71.27,21.59 T90.B | T82.B 21.91,21.91 21.59,21.59 | T83.B 28.26,21.91 27.94,21.59 | T84.B 34.61,21.91 34.29,21.59 | T85.B 40.96,21.91 40.64,21.59 | T86.B 47.31,21.91 46.99,21.59 | T87.B 53.66,21.91 53.34,21.59 | T88.B 60.01,21.91 59.69,21.59 | T89.B 66.36,21.91 66.04,21.59
N$56
  Top 0.152: T41.C 16.51,50.8
  Top 0.254: JP41.1 15.24,52.07 16.51,50.8
N$57
  Top 0.152: T42.C 22.86,50.8
  Top 0.254: JP42.1 21.59,52.07 22.86,50.8
N$58
  Top 0.152: T43.C 29.21,50.8
  Top 0.254: JP43.1 27.94,52.07 29.21,50.8
N$59
  Top 0.152: T44.C 35.56,50.8
  Top 0.254: JP44.1 34.29,52.07 35.56,50.8
N$60
  Top 0.152: T45.C 41.91,50.8
  Top 0.254: JP45.1 40.64,52.07 41.91,50.8
N$61
  Top 0.152: T46.C 48.26,50.8
  Top 0.254: JP46.1 46.99,52.07 48.26,50.8
N$62
  Top 0.254: 53.17,52.07 JP47.1
  Top 0.305: 53.17,52.07 53.34,52.07 54.61,50.8 T47.C
N$63
  Top 0.305: JP48.1 59.52,52.07 T48.C
N$64
  Top 0.305: JP49.1 65.87,52.07 T49.C
N$65
  Top 0.305: JP50.1 72.22,52.07 T50.C
N$66
  Top 0.305: 21.59,27.94 16.51,27.94 15.56,28.89 T71.B 15.39,29.21 T118.C | 21.59,27.94 27.94,27.94 | 27.94,27.94 34.29,27.94 | 34.29,27.94 40.64,27.94 | 40.64,27.94 46.99,27.94 | 46.99,27.94 53.34,27.94 | 53.34,27.94 59.69,27.94 | 59.69,27.94 66.04,27.94 | 66.04,27.94 71.27,27.94 T80.B | T72.B 21.91,28.26 21.59,27.94 | T73.B 28.26,28.26 27.94,27.94 | T74.B 34.61,28.26 34.29,27.94 | T75.B 40.96,28.26 40.64,27.94 | T76.B 47.31,28.26 46.99,27.94 | T77.B 53.66,28.26 53.34,27.94 | T78.B 60.01,28.26 59.69,27.94 | T79.B 66.36,28.26 66.04,27.94
N$67
  Top 0.305: JP51.1 15.07,45.72 T51.C
N$68
  Top 0.305: JP52.1 21.42,45.72 T52.C
N$69
  Top 0.305: JP53.1 27.77,45.72 T53.C
N$70
  Top 0.305: JP54.1 34.12,45.72 T54.C
N$71
  Top 0.305: JP55.1 40.47,45.72 T55.C
N$72
  Top 0.305: JP56.1 46.82,45.72 T56.C
N$73
  Top 0.305: JP57.1 53.17,45.72 T57.C
N$74
  Top 0.305: JP58.1 59.52,45.72 T58.C
N$75
  Top 0.305: JP59.1 65.87,45.72 T59.C
N$76
  Top 0.305: JP60.1 72.22,45.72 T60.C
N$77
  Top 0.305: 21.59,34.29 16.51,34.29 15.56,35.24 T61.B 15.39,35.56 T117.C | 21.59,34.29 27.94,34.29 | 27.94,34.29 34.29,34.29 | 34.29,34.29 40.64,34.29 | 40.64,34.29 46.99,34.29 | 46.99,34.29 53.34,34.29 | 53.34,34.29 59.69,34.29 | 59.69,34.29 66.04,34.29 | 66.04,34.29 71.27,34.29 T70.B | T62.B 21.91,34.61 21.59,34.29 | T63.B 28.26,34.61 27.94,34.29 | T64.B 34.61,34.61 34.29,34.29 | T65.B 40.96,34.61 40.64,34.29 | T66.B 47.31,34.61 46.99,34.29 | T67.B 53.66,34.61 53.34,34.29 | T68.B 60.01,34.61 59.69,34.29 | T69.B 66.36,34.61 66.04,34.29
N$78
  Top 0.305: JP61.1 15.07,39.37 T61.C
N$79
  Top 0.305: JP62.1 21.59,39.37 22.86,38.1 T62.C
N$80
  Top 0.305: JP63.1 27.77,39.37 T63.C
N$81
  Top 0.305: JP64.1 34.12,39.37 T64.C
N$82
  Top 0.305: JP65.1 40.47,39.37 T65.C
N$83
  Top 0.305: JP66.1 46.82,39.37 T66.C
N$84
  Top 0.305: JP67.1 53.17,39.37 T67.C
N$85
  Top 0.305: JP68.1 59.52,39.37 T68.C
N$86
  Top 0.305: JP69.1 65.87,39.37 T69.C
N$87
  Top 0.305: JP70.1 72.22,39.37 T70.C
N$88
  Top 0.305: 21.59,40.64 16.51,40.64 15.56,41.59 T51.B 15.39,41.91 T116.C | 21.59,40.64 27.94,40.64 | 27.94,40.64 34.29,40.64 | 34.29,40.64 40.64,40.64 | 40.64,40.64 46.99,40.64 | 46.99,40.64 53.34,40.64 | 53.34,40.64 59.69,40.64 | 59.69,40.64 66.04,40.64 | 66.04,40.64 71.27,40.64 T60.B | T52.B 21.91,40.96 21.59,40.64 | T53.B 28.26,40.96 27.94,40.64 | T54.B 34.61,40.96 34.29,40.64 | T55.B 40.96,40.96 40.64,40.64 | T56.B 47.31,40.96 46.99,40.64 | T57.B 53.66,40.96 53.34,40.64 | T58.B 60.01,40.96 59.69,40.64 | T59.B 66.36,40.96 66.04,40.64
N$89
  Top 0.305: JP71.1 15.07,33.02 T71.C
N$90
  Top 0.305: JP72.1 21.42,33.02 T72.C
N$91
  Top 0.305: JP73.1 27.77,33.02 T73.C
N$92
  Top 0.305: JP74.1 34.12,33.02 T74.C
N$93
  Top 0.305: JP75.1 40.47,33.02 T75.C
N$94
  Top 0.305: JP76.1 46.82,33.02 T76.C
N$95
  Top 0.305: JP77.1 53.17,33.02 T77.C
N$96
  Top 0.305: JP78.1 59.52,33.02 T78.C
N$97
  Top 0.305: JP79.1 65.87,33.02 T79.C
N$98
  Top 0.305: JP80.1 72.22,33.02 T80.C
N$99
  Top 0.305: 21.59,46.99 16.51,46.99 15.56,47.94 T41.B 15.39,48.26 T115.C | 21.59,46.99 27.94,46.99 | 27.94,46.99 34.29,46.99 | 34.29,46.99 40.64,46.99 | 40.64,46.99 46.99,46.99 | 46.99,46.99 53.34,46.99 | 53.34,46.99 59.69,46.99 | 59.69,46.99 66.04,46.99 | 66.04,46.99 71.27,46.99 T50.B | T42.B 21.91,47.31 21.59,46.99 | T43.B 28.26,47.31 27.94,46.99 | T44.B 34.61,47.31 34.29,46.99 | T45.B 40.96,47.31 40.64,46.99 | T46.B 47.31,47.31 46.99,46.99 | T47.B 53.66,47.31 53.34,46.99 | T48.B 60.01,47.31 59.69,46.99 | T49.B 66.36,47.31 66.04,46.99
N$100
  Top 0.305: JP81.1 15.07,26.67 T81.C
N$101
  Top 0.305: JP82.1 21.42,26.67 T82.C
N$102
  Top 0.305: JP83.1 27.77,26.67 T83.C
N$103
  Top 0.305: JP84.1 34.12,26.67 T84.C
N$104
  Top 0.305: JP85.1 40.47,26.67 T85.C
N$105
  Top 0.305: JP86.1 46.82,26.67 T86.C
N$106
  Top 0.305: JP87.1 53.17,26.67 T87.C
N$107
  Top 0.305: JP88.1 59.52,26.67 T88.C
N$108
  Top 0.305: JP89.1 65.87,26.67 T89.C
N$109
  Top 0.305: JP90.1 72.22,26.67 T90.C
N$110
  Top 0.305: 21.59,53.34 16.51,53.34 15.56,54.29 T31.B 15.39,54.61 T114.C | 21.59,53.34 27.94,53.34 | 27.94,53.34 34.29,53.34 | 34.29,53.34 40.64,53.34 | 40.64,53.34 46.99,53.34 | 46.99,53.34 53.34,53.34 | 53.34,53.34 59.69,53.34 | 59.69,53.34 66.04,53.34 | 66.04,53.34 71.27,53.34 T40.B | T32.B 21.91,53.66 21.59,53.34 | T33.B 28.26,53.66 27.94,53.34 | T34.B 34.61,53.66 34.29,53.34 | T35.B 40.96,53.66 40.64,53.34 | T36.B 47.31,53.66 46.99,53.34 | T37.B 53.66,53.66 53.34,53.34 | T38.B 60.01,53.66 59.69,53.34 | T39.B 66.36,53.66 66.04,53.34
N$111
  Top 0.305: JP91.1 15.07,20.32 T91.C
N$112
  Top 0.305: JP92.1 21.42,20.32 T92.C
N$113
  Top 0.305: JP93.1 27.77,20.32 T93.C
N$114
  Top 0.305: JP94.1 34.12,20.32 T94.C
N$115
  Top 0.305: JP95.1 40.47,20.32 T95.C
N$116
  Top 0.305: JP96.1 46.82,20.32 T96.C
N$117
  Top 0.305: JP97.1 53.17,20.32 T97.C
N$118
  Top 0.305: JP98.1 59.52,20.32 T98.C
N$119
  Top 0.305: JP99.1 65.87,20.32 T99.C
N$120
  Top 0.305: JP100.1 72.22,20.32 T100.C
N$121
  Top 0.406: T121.C 15.24,10.01 T101.B
N$122
  Top 0.406: T122.C 21.59,10.01 T102.B
N$123
  Top 0.406: T123.C 27.94,10.01 T103.B
N$124
  Top 0.406: T124.C 34.29,10.01 T104.B
N$125
  Top 0.406: T125.C 40.64,10.16 40.79,10.16 T105.B
N$126
  Top 0.406: T126.C 46.99,10.01 T106.B
N$127
  Top 0.406: 53.34,10.16 53.51,10.33 T107.B 53.34,10.01 T127.C
N$128
  Top 0.406: T128.C 59.69,10.01 T108.B
N$129
  Top 0.406: T129.C 66.04,10.01 T109.B
N$130
  Top 0.406: T130.C 72.39,10.01 T110.B
N$131  (via drill 0.6)
  Top 0.406: T130.E 73.34,4.13 v73.66,3.81 | 16.19,4.76 T121.E | v16.51,3.81 16.19,4.13 16.19,4.76 | T122.E 22.54,4.13 v22.86,3.81 | T123.E 28.89,4.13 v29.21,3.81 | T124.E 35.24,4.13 v35.56,3.81 | T125.E 41.59,4.13 v41.91,3.81 | T126.E 47.94,4.13 v48.26,3.81 | T127.E 54.29,4.13 v54.61,3.81 | T128.E 60.64,4.13 v60.96,3.81 | T129.E 66.99,4.13 v67.31,3.81 | 16.19,4.76 19.05,7.62 19.05,10.16 20.32,11.43 v20.32,13.97 | R1.1 11.11,76.52 11.43,76.2 v12.7,76.2
  Bottom 0.406: v16.51,3.81 v22.86,3.81 v29.21,3.81 v35.56,3.81 v41.91,3.81 v48.26,3.81 v54.61,3.81 v60.96,3.81 v67.31,3.81 v73.66,3.81 | v20.32,13.97 22.86,13.97 24.13,15.24 24.13,76.2 v12.7,76.2
N$132  (via drill 0.6)
  Top 0.406: T111.E 9.21,72.71 v8.89,72.39 | T120.E 9.21,15.56 v8.89,15.24 | T119.E 9.21,21.91 v8.89,21.59 | T118.E 9.21,28.26 v8.89,27.94 | T117.E 9.21,34.61 v8.89,34.29 | T116.E 9.21,40.96 v8.89,40.64 | T115.E 9.21,47.31 v8.89,46.99 | T114.E 9.21,53.66 v8.89,53.34 | T113.E 9.21,60.01 v8.89,59.69 | T112.E 9.21,66.36 v8.89,66.04 | v6.35,73.66 R2.1
  Bottom 0.406: v8.89,15.24 v8.89,21.59 v8.89,27.94 v8.89,34.29 v8.89,40.64 v8.89,46.99 v8.89,53.34 v8.89,59.69 v8.89,66.04 v8.89,72.39 7.62,73.66 v6.35,73.66
VCC
  Top 0.406: R1.2 R2.2 3.49,78.42 JP102.2
X1
  Top 0.406: T121.B 13.8,5.25 12.7,6.35 JP101.1
X2
  Top 0.406: T122.B 20.49,5.25 17.78,2.54 13.97,2.54 11.43,5.08 2.54,5.08 JP101.2
X3  (via drill 0.6)
  Top 0.406: T123.B 26.84,5.25 25.4,3.81 v25.4,2.54
  Bottom 0.406: JP101.3 7.62,5.08 10.16,5.08 12.7,2.54 v25.4,2.54
X4  (via drill 0.6)
  Top 0.406: T124.B 33.19,5.25 31.75,3.81 v31.75,2.54
  Bottom 0.406: JP101.4 2.54,7.62 2.54,5.08 6.35,5.08 7.62,3.81 10.16,3.81 12.7,1.27 26.67,1.27 27.94,2.54 v31.75,2.54
X5  (via drill 0.6)
  Top 0.406: T125.B 38.27,5.25 v38.1,5.08
  Bottom 0.406: JP101.5 8.89,6.35 10.16,6.35 11.43,5.08 v38.1,5.08
X6  (via drill 0.6)
  Top 0.406: T126.B 44.62,5.25 v44.45,5.08
  Bottom 0.406: JP101.6 2.54,12.7 5.08,12.7 11.43,6.35 39.37,6.35 40.64,5.08 v44.45,5.08
X7  (via drill 0.6)
  Top 0.406: T127.B 51.9,5.25 50.8,6.35 v50.8,10.16
  Bottom 0.406: JP101.7 5.08,13.97 8.89,10.16 v50.8,10.16
X8  (via drill 0.6)
  Top 0.406: JP101.8 2.54,12.7 5.08,12.7 10.16,7.62 v12.7,7.62 | T128.B 58.74,6.03 58.42,6.35 v57.15,6.35
  Bottom 0.406: v12.7,7.62 39.37,7.62 40.64,6.35 v57.15,6.35
X9  (via drill 0.6)
  Top 0.406: JP101.9 7.62,12.7 v10.16,12.7 | T129.B 65.09,6.03 64.77,6.35 v64.77,12.7
  Bottom 0.406: v10.16,12.7 v64.77,12.7
X10  (via drill 0.6)
  Top 0.406: T130.B 71.44,6.03 71.12,6.35 71.12,10.16 v69.85,11.43
  Bottom 0.406: JP101.10 2.54,15.24 5.08,15.24 8.89,11.43 v69.85,11.43
Y1
  Top 0.406: T111.B 9.21,74.61 8.89,74.93 7.62,74.93 7.62,69.85 1.27,69.85 JP101.20
Y2
  Top 0.406: T112.B 9.21,68.26 8.89,68.58 3.81,68.58 JP101.19
Y3  (via drill 0.6)
  Top 0.406: T113.B 9.21,61.91 8.89,62.23 v5.08,62.23 | JP101.18 2.54,27.94 v2.54,62.23
  Bottom 0.406: v2.54,62.23 v5.08,62.23
Y4  (via drill 0.6)
  Top 0.406: T114.B 9.21,55.56 8.89,55.88 v5.08,55.88
  Bottom 0.406: JP101.17 2.54,27.94 2.54,55.88 v5.08,55.88
Y5  (via drill 0.6)
  Top 0.406: T115.B 9.21,49.21 8.89,49.53 v5.08,49.53
  Bottom 0.406: JP101.16 2.54,25.4 5.08,25.4 v5.08,49.53
Y6
  Top 0.406: T116.B 9.21,42.86 8.89,43.18 5.08,43.18 5.08,25.4 JP101.15
Y7  (via drill 0.6)
  Top 0.406: T117.B 9.21,36.51 8.89,36.83 v6.35,36.83
  Bottom 0.406: JP101.14 2.54,22.86 5.08,22.86 6.35,24.13 v6.35,36.83
Y8
  Top 0.406: T118.B 9.21,30.16 8.89,30.48 6.35,30.48 6.35,24.13 JP101.13
Y9
  Top 0.406: T119.B 9.21,23.81 8.89,24.13 7.62,24.13 6.35,22.86 6.35,21.59 5.08,20.32 2.54,20.32 JP101.12
Y10
  Top 0.406: T120.B 9.21,17.46 7.62,19.05 JP101.11

### Text on the board
tPlace: VCC | -100V